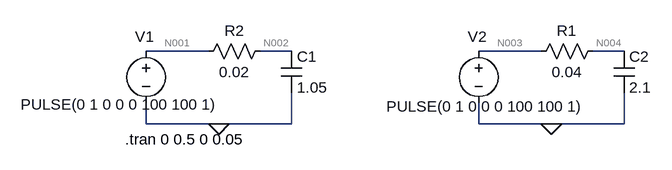
[diagram p0: schematic thermal_example.asc]
thermal_example.asc, the LTspice schematic file:
Version 4
SHEET 1 940 680
WIRE 176 112 80 112
WIRE 304 112 256 112
WIRE 688 112 592 112
WIRE 816 112 768 112
WIRE 80 224 80 192
WIRE 192 224 80 224
WIRE 304 224 304 176
WIRE 304 224 192 224
WIRE 592 224 592 192
WIRE 704 224 592 224
WIRE 816 224 816 176
WIRE 816 224 704 224
FLAG 192 224 0
FLAG 704 224 0
SYMBOL res 272 96 R90
WINDOW 0 0 56 VBottom 2
WINDOW 3 32 56 VTop 2
SYMATTR InstName R2
SYMATTR Value 0.02
SYMBOL cap 288 112 R0
SYMATTR InstName C1
SYMATTR Value 1.05
SYMBOL res 784 96 R90
WINDOW 0 0 56 VBottom 2
WINDOW 3 32 56 VTop 2
SYMATTR InstName R1
SYMATTR Value 0.04
SYMBOL cap 800 112 R0
SYMATTR InstName C2
SYMATTR Value 2.1
SYMBOL voltage 592 96 R0
WINDOW 0 -17 -7 Left 2
WINDOW 3 -142 101 Left 2
WINDOW 123 0 0 Left 0
WINDOW 39 0 0 Left 0
SYMATTR InstName V2
SYMATTR Value PULSE(0 1 0 0 0 100 100 1)
SYMBOL voltage 80 96 R0
WINDOW 0 -17 -7 Left 2
WINDOW 3 -193 98 Left 2
WINDOW 123 0 0 Left 0
WINDOW 39 0 0 Left 0
SYMATTR InstName V1
SYMATTR Value PULSE(0 1 0 0 0 100 100 1)
TEXT 48 248 Left 2 !.tran 0 0.5 0 0.05

The netlist it stands for:
* thermal_example.asc
R2 N002 N001 0.02
C1 N002 0 1.05
R1 N004 N003 0.04
C2 N004 0 2.1
V2 N003 0 PULSE(0 1 0 0 0 100 100 1)
V1 N001 0 PULSE(0 1 0 0 0 100 100 1)
.tran 0 0.5 0 0.05
.backanno
.end

* Results of the author's LTspice run, read from the files saved beside the schematic
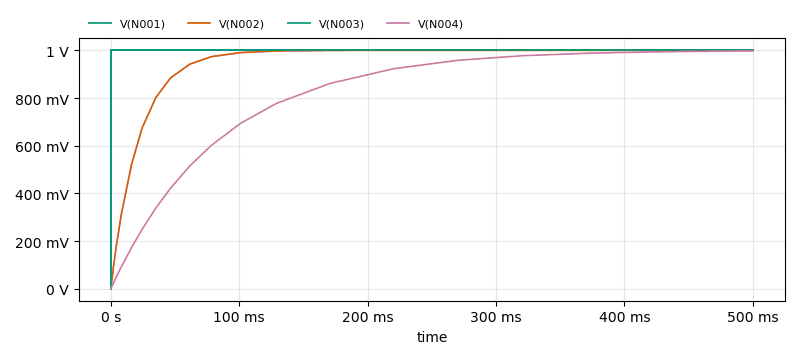
[diagram p1: Transient Analysis of thermal_example.asc, plotted from the saved traces]
* Transient Analysis, 1 run:
*   V(N001): min 0 V, max 1 V, average 1 V, rms 1 V, last 1 V
*   V(N002): min 0 V, max 1 V, average 956 mV, rms 966.6 mV, last 1 V
*   V(N003): min 0 V, max 1 V, average 1 V, rms 1 V, last 1 V
*   V(N004): min 0 V, max 997.7 mV, average 828.6 mV, rms 862.2 mV, last 997.7 mV